# Altium schematic sheet ExchangeDisplay.SchDoc
size A4
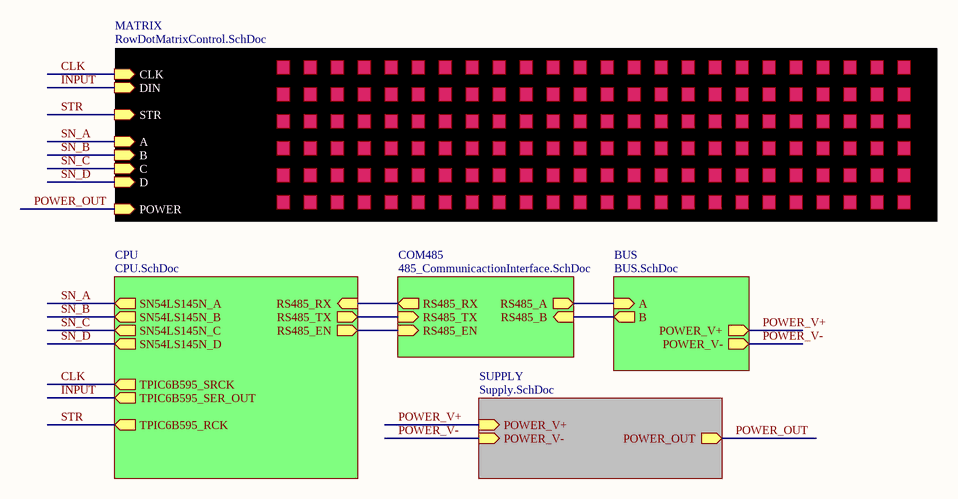
[diagram p0: ExchangeDisplay.SchDoc]

## Sub-sheets
BUS = BUS.SchDoc: A (in), B (out), POWER_V+ (out), POWER_V- (out)
COM485 = 485_CommunicactionInterface.SchDoc: RS485_RX (out), RS485_TX (in), RS485_EN (in), RS485_A (out), RS485_B (in)
CPU = CPU.SchDoc: RS485_RX (in), RS485_TX (out), RS485_EN (out), TPIC6B595_SRCK (out), TPIC6B595_SER_OUT (out), TPIC6B595_RCK (out), SN54LS145N_A (out), SN54LS145N_B (out), SN54LS145N_C (out), SN54LS145N_D (out)
MATRIX = RowDotMatrixControl.SchDoc: CLK (in), DIN (in), STR (in), POWER (in), A (in), B (in), C (in), D (in)
SUPPLY = Supply.SchDoc: POWER_V+ (in), POWER_V- (in), POWER_OUT (out)

## Nets
CLK: sheet CPU/TPIC6B595_SRCK, sheet MATRIX/CLK
INPUT: sheet CPU/TPIC6B595_SER_OUT, sheet MATRIX/DIN
POWER_OUT: sheet MATRIX/POWER, sheet SUPPLY/POWER_OUT
POWER_V+: sheet BUS/POWER_V+, sheet SUPPLY/POWER_V+
POWER_V-: sheet BUS/POWER_V-, sheet SUPPLY/POWER_V-
SN_A: sheet CPU/SN54LS145N_A, sheet MATRIX/A
SN_B: sheet CPU/SN54LS145N_B, sheet MATRIX/B
SN_C: sheet CPU/SN54LS145N_C, sheet MATRIX/C
SN_D: sheet CPU/SN54LS145N_D, sheet MATRIX/D
STR: sheet CPU/TPIC6B595_RCK, sheet MATRIX/STR
(unnamed): sheet CPU/RS485_RX, sheet COM485/RS485_RX
(unnamed): sheet CPU/RS485_TX, sheet COM485/RS485_TX
(unnamed): sheet CPU/RS485_EN, sheet COM485/RS485_EN
(unnamed): sheet COM485/RS485_A, sheet BUS/A
(unnamed): sheet COM485/RS485_B, sheet BUS/B